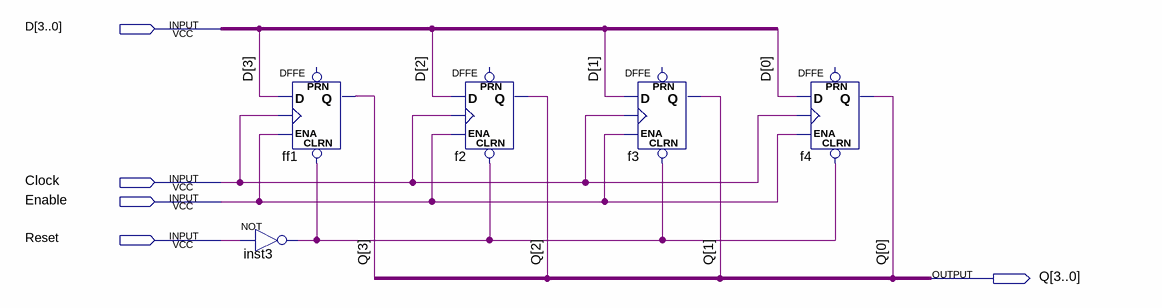
[diagram p0: schematic sheet]
// Quartus schematic register4.bdf as structural Verilog: 5 symbols, 5 pins
module register4 (
  input  [3:0] D,
  input  Clock,
  input  Enable,
  input  Reset,
  output [3:0] Q
);

  wire inst3_out;

  not inst3 (inst3_out, Reset);
  DFFE ff1 (.CLRN(inst3_out), .D(D[3]), .CLK(Clock), .ENA(Enable), .Q(Q[3]));  // open: PRN
  DFFE f2 (.CLRN(inst3_out), .D(D[2]), .CLK(Clock), .ENA(Enable), .Q(Q[2]));  // open: PRN
  DFFE f3 (.CLRN(inst3_out), .D(D[1]), .CLK(Clock), .ENA(Enable), .Q(Q[1]));  // open: PRN
  DFFE f4 (.CLRN(inst3_out), .D(D[0]), .CLK(Clock), .ENA(Enable), .Q(Q[0]));  // open: PRN
endmodule
